# Altium schematic sheet Teensy.SchDoc
size A4
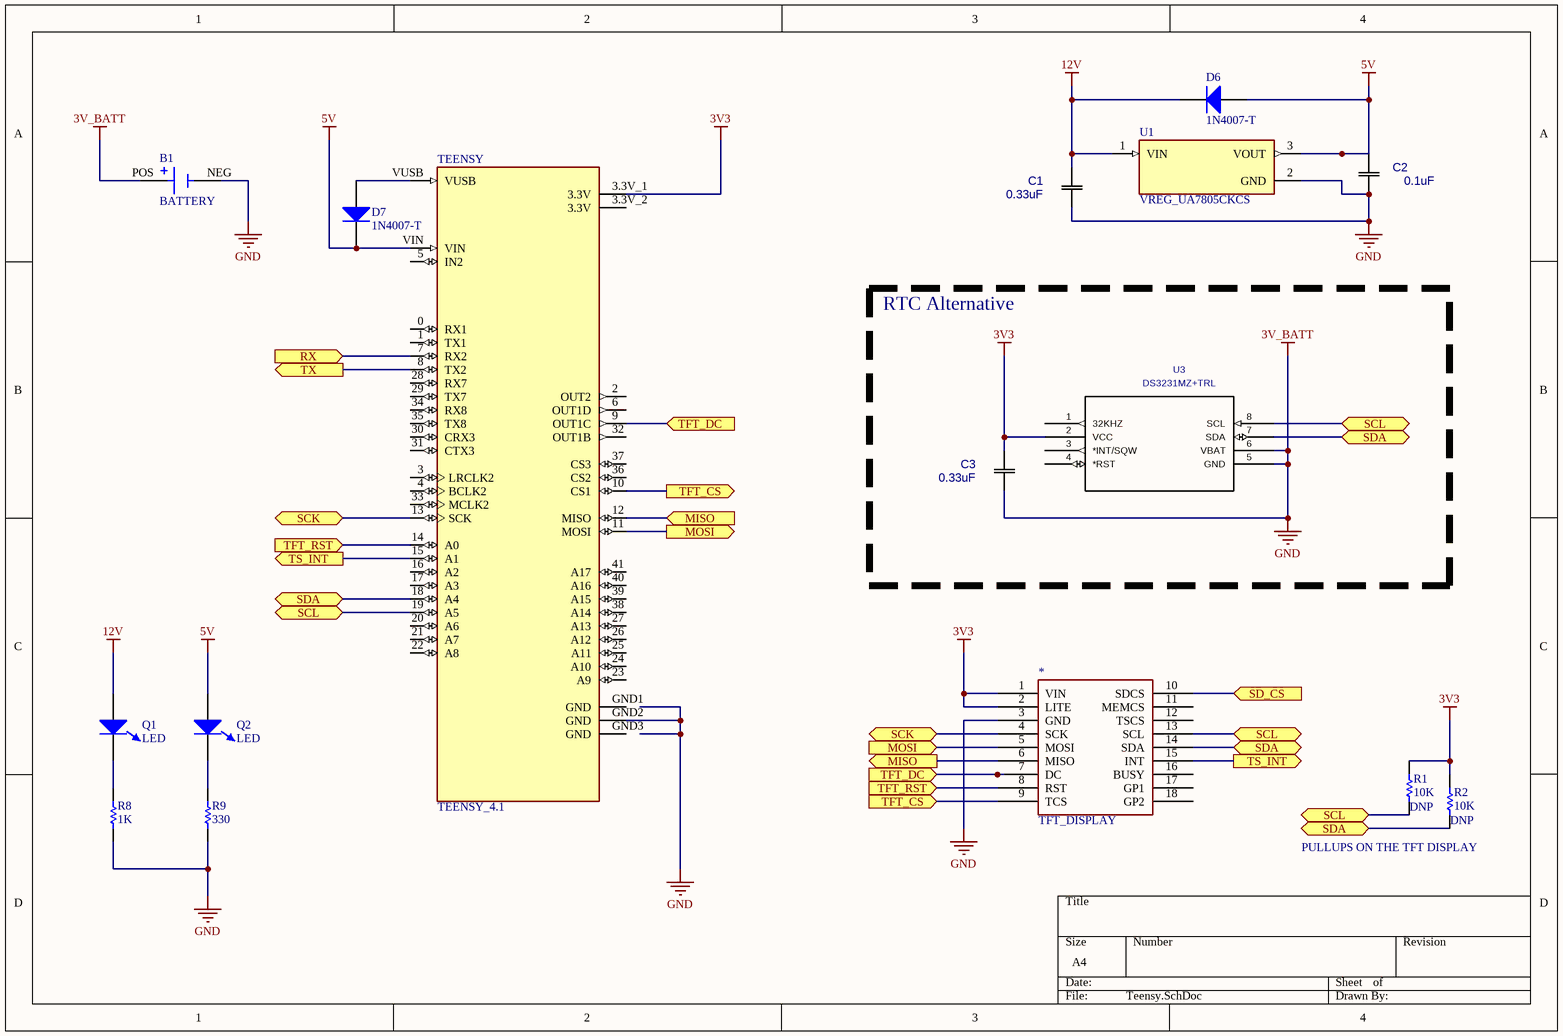
[diagram p0: Teensy.SchDoc]

## Parts
*  TFT_DISPLAY
B1  BATTERY
C1  value 0.33uF  [CAP_TH_CER_5MM]  (hidden comment: CAP_TH_CER)
C2  value 0.1uF  [CAP_TH_CER_5MM]  (hidden comment: CAP_TH_CER)
C3  value 0.33uF  [CAP_TH_CER_5MM]  (hidden comment: CAP_TH_CER)
D6  1N4007-T
D7  1N4007-T
Q1  LED  [DIODE_0603]
Q2  LED  [DIODE_0603]
R1  10K  NOTE: DNP
R2  10K  NOTE: DNP
R8  1K
R9  330
TEENSY  TEENSY_4.1  [TEENSY_4.1]
U1  VREG_UA7805CKCS  [TO-220-3_7805]
U3  DS3231MZ+TRL  [8-SOIC-3.90MM]

## Blocks framed on the sheet
RTC Alternative: C3 U3

## Ports
MISO, MOSI, RX, SCK, SCL, SD_CS, SDA, TFT_CS, TFT_DC, TFT_RST, TS_INT, TX

## Nets
3V3: *.1(VIN) *.2(LITE) C3.2 R1.2 R2.2 TEENSY.3.3V_1(3.3V) U3.2(VCC)
3V_BATT: *.3(GND) B1.NEG B1.POS C1.1 C2.1 C3.1 R8.1 R9.1 TEENSY.GND2(GND) U1.2(GND) U3.5(GND) U3.6(VBAT)  [also labelled GND]
5V: C2.2 D6.1(A) D7.2(K) Q2.1(A) TEENSY.VIN U1.3(VOUT)
12V: C1.2 D6.2(K) Q1.1(A) U1.1(VIN)
MISO: *.6(MISO) TEENSY.12(MISO) ; port MISO
MOSI: *.5(MOSI) TEENSY.11(MOSI) ; port MOSI
RX: TEENSY.7(RX2) ; port RX
SCK: *.4(SCK) TEENSY.13(SCK) ; port SCK
SCL: *.13(SCL) R1.1 TEENSY.19(A5) U3.8(SCL) ; port SCL
SD_CS: *.10(SDCS) ; port SD_CS
SDA: *.14(SDA) R2.1 TEENSY.18(A4) U3.7(SDA) ; port SDA
TFT_CS: *.9(TCS) TEENSY.10(CS1) ; port TFT_CS
TFT_DC: *.7(DC) TEENSY.9(OUT1C) ; port TFT_DC
TFT_RST: *.8(RST) TEENSY.14(A0) ; port TFT_RST
TS_INT: *.15(INT) TEENSY.15(A1) ; port TS_INT
TX: TEENSY.8(TX2) ; port TX
NetD7_1: D7.1(A) TEENSY.VUSB
NetQ1_2: Q1.2(K) R8.2
NetQ2_2: Q2.2(K) R9.2

Not connected (* = marked no-connect by the designer): * 11(MEMCS) 12(TSCS) 16(BUSY) 17(GP1) 18(GP2); TEENSY 0(RX1) 1(TX1) 2(OUT2) 3(LRCLK2) 3.3V_2(3.3V) 4(BCLK2) 5(IN2) 6(OUT1D) 16(A2) 17(A3) 20(A6) 21(A7) 22(A8) 23(A9) 24(A10) 25(A11) 26(A12) 27(A13) 28(RX7) 29(TX7) 30(CRX3) 31(CTX3) 32(OUT1B) 33(MCLK2) 34(RX8) 35(TX8) 36(CS2) 37(CS3) 38(A14) 39(A15) 40(A16) 41(A17) GND1(GND) GND3(GND); U3 1(32KHZ) 3(*INT/SQW) 4(*RST)

## Notes on the sheet
- PULLUPS ON THE TFT DISPLAY

## Library data of the parts
* = EYESPI_TFT_BREAKOUT
B1 = BATTERY: MPN: 1060TR
C1-C3 = CAP_TH_CER: Mfr_Name: TDK
D6 D7 = DIODE
Q1 Q2 = DIODE_LED
R1 R2 R8 R9 = RES: Resistor; Value: ? Ohms; MPN: ?; SuppliersPartNumber: ?; Power: ?
TEENSY = TEENSY_4.1: TEENSY 4.1
U1 = VREG_UA7805CKCS: 1.5-A, 38-V, linear voltage regulator; Price: None; MP: UA7805CKCS; Value: *; Availability: Unavailable; Package: None
U3 = IC_RTC_DS3231MZ+TRL: Mfr_Name: Analog Devices Inc; Value: DS3231MZ+TRL; Manufacturer_Part_Number: DS3231MZ+TRL